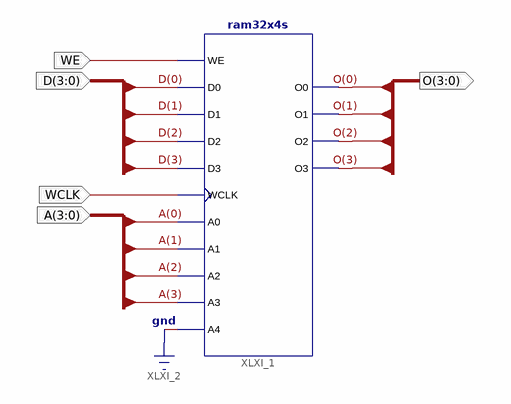
[diagram p0: schematic sheet 1]
// Xilinx ISE schematic sch.sch (spartan3e) as structural Verilog: 1 symbols, 5 ports
module sch (
  input  [3:0] A,
  input  [3:0] D,
  input  WE,
  input  WCLK,
  output [3:0] O
);

  ram32x4s XLXI_1 (
    .A0(A[0]), .A1(A[1]), .A2(A[2]), .A3(A[3]), .A4(1'b0), .D0(D[0]), .D1(D[1]), .D2(D[2]), .D3(D[3]),
    .WCLK(WCLK), .WE(WE), .O0(O[0]), .O1(O[1]), .O2(O[2]), .O3(O[3]));
endmodule
